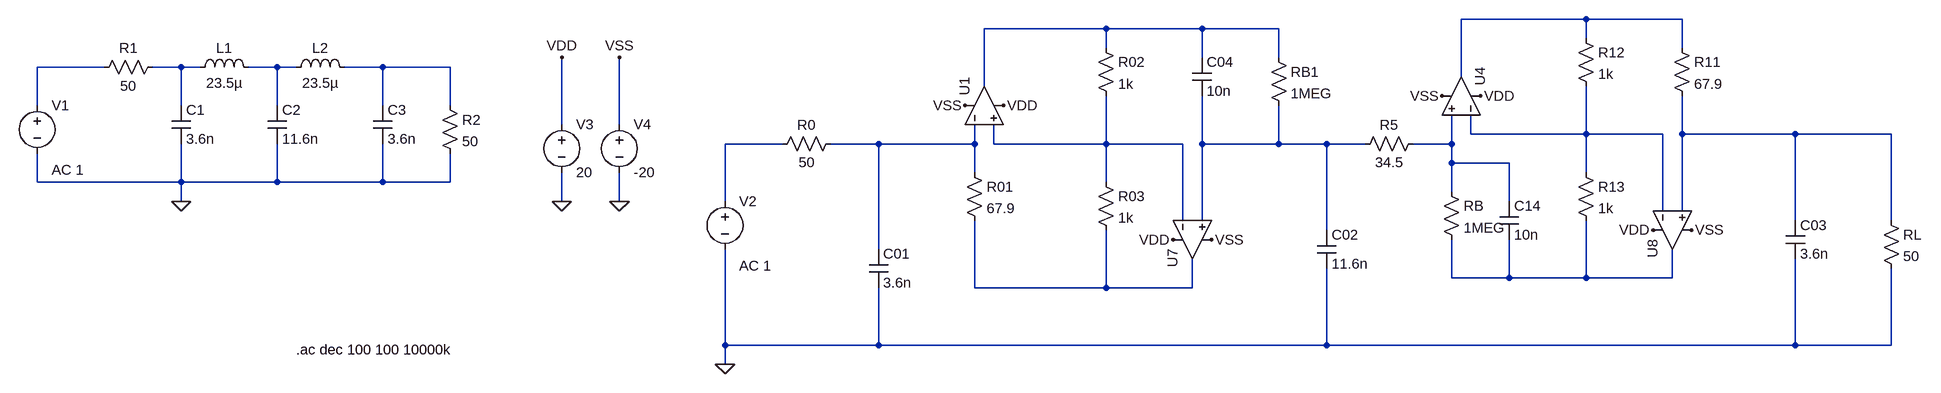
[diagram p0: schematic Gyrator.asc]
Gyrator.asc, the LTspice schematic file:
Version 4
SHEET 1 6264 1380
WIRE 2480 -16 2272 -16
WIRE 2640 -16 2480 -16
WIRE 1680 0 1472 0
WIRE 1840 0 1680 0
WIRE 1968 0 1840 0
WIRE 2480 16 2480 -16
WIRE 1680 32 1680 0
WIRE 2640 32 2640 -16
WIRE 1840 48 1840 0
WIRE 1968 48 1968 0
WIRE -16 64 -128 64
WIRE 112 64 64 64
WIRE 144 64 112 64
WIRE 272 64 224 64
WIRE 304 64 272 64
WIRE 448 64 384 64
WIRE 560 64 448 64
WIRE 2272 80 2272 -16
WIRE 1472 96 1472 0
WIRE -128 128 -128 64
WIRE 112 128 112 64
WIRE 272 128 272 64
WIRE 448 128 448 64
WIRE 560 128 560 64
WIRE 768 160 768 48
WIRE 864 160 864 48
WIRE 2288 176 2288 144
WIRE 2480 176 2480 96
WIRE 2480 176 2288 176
WIRE 2608 176 2480 176
WIRE 2640 176 2640 112
WIRE 2944 176 2640 176
WIRE 3104 176 2944 176
WIRE 1136 192 1040 192
WIRE 1296 192 1216 192
WIRE 1456 192 1456 160
WIRE 1456 192 1296 192
WIRE 1488 192 1488 160
WIRE 1680 192 1680 112
WIRE 1680 192 1488 192
WIRE 1808 192 1680 192
WIRE 1840 192 1840 112
WIRE 1968 192 1968 128
WIRE 1968 192 1840 192
WIRE 2048 192 1968 192
WIRE 2112 192 2048 192
WIRE 2256 192 2256 144
WIRE 2256 192 2192 192
WIRE 2256 224 2256 192
WIRE 2352 224 2256 224
WIRE 1456 240 1456 192
WIRE 2480 240 2480 176
WIRE -128 256 -128 208
WIRE 112 256 112 192
WIRE 112 256 -128 256
WIRE 272 256 272 192
WIRE 272 256 112 256
WIRE 448 256 448 192
WIRE 448 256 272 256
WIRE 560 256 560 208
WIRE 560 256 448 256
WIRE 1680 256 1680 192
WIRE 2256 272 2256 224
WIRE 112 288 112 256
WIRE 768 288 768 240
WIRE 864 288 864 240
WIRE 1040 288 1040 192
WIRE 2352 288 2352 224
WIRE 2608 304 2608 176
WIRE 2640 304 2640 176
WIRE 1808 320 1808 192
WIRE 1840 320 1840 192
WIRE 2944 320 2944 176
WIRE 3104 320 3104 176
WIRE 2048 336 2048 192
WIRE 1296 368 1296 192
WIRE 2256 416 2256 352
WIRE 2352 416 2352 352
WIRE 2352 416 2256 416
WIRE 2480 416 2480 320
WIRE 2480 416 2352 416
WIRE 2624 416 2624 368
WIRE 2624 416 2480 416
WIRE 1456 432 1456 320
WIRE 1680 432 1680 336
WIRE 1680 432 1456 432
WIRE 1824 432 1824 384
WIRE 1824 432 1680 432
WIRE 1040 528 1040 368
WIRE 1296 528 1296 432
WIRE 1296 528 1040 528
WIRE 2048 528 2048 400
WIRE 2048 528 1296 528
WIRE 2944 528 2944 384
WIRE 2944 528 2048 528
WIRE 3104 528 3104 400
WIRE 3104 528 2944 528
WIRE 1040 560 1040 528
FLAG 112 288 0
FLAG 1040 560 0
FLAG 768 288 0
FLAG 864 288 0
FLAG 768 48 VDD
FLAG 864 48 VSS
FLAG 1504 128 VDD
FLAG 2304 112 VDD
FLAG 1792 352 VDD
FLAG 2592 336 VDD
FLAG 1440 128 VSS
FLAG 1856 352 VSS
FLAG 2240 112 VSS
FLAG 2656 336 VSS
SYMBOL res 80 48 R90
WINDOW 0 0 56 VBottom 2
WINDOW 3 32 56 VTop 2
SYMATTR InstName R1
SYMATTR Value 50
SYMBOL ind 128 80 R270
WINDOW 0 32 56 VTop 2
WINDOW 3 5 56 VBottom 2
SYMATTR InstName L1
SYMATTR Value 23.5µ
SYMBOL ind 288 80 R270
WINDOW 0 32 56 VTop 2
WINDOW 3 5 56 VBottom 2
SYMATTR InstName L2
SYMATTR Value 23.5µ
SYMBOL cap 96 128 R0
SYMATTR InstName C1
SYMATTR Value 3.6n
SYMBOL cap 256 128 R0
SYMATTR InstName C2
SYMATTR Value 11.6n
SYMBOL cap 432 128 R0
SYMATTR InstName C3
SYMATTR Value 3.6n
SYMBOL res 544 112 R0
SYMATTR InstName R2
SYMATTR Value 50
SYMBOL voltage -128 112 R0
WINDOW 123 24 124 Left 2
WINDOW 39 0 0 Left 2
SYMATTR Value2 AC 1
SYMATTR InstName V1
SYMATTR Value ""
SYMBOL res 1232 176 R90
WINDOW 0 0 56 VBottom 2
WINDOW 3 32 56 VTop 2
SYMATTR InstName R0
SYMATTR Value 50
SYMBOL voltage 1040 272 R0
WINDOW 3 24 152 Left 2
WINDOW 123 24 124 Left 2
WINDOW 39 0 0 Left 2
SYMATTR Value ""
SYMATTR Value2 AC 1
SYMATTR InstName V2
SYMBOL voltage 768 144 R0
WINDOW 123 0 0 Left 2
WINDOW 39 0 0 Left 2
SYMATTR InstName V3
SYMATTR Value 20
SYMBOL voltage 864 144 R0
WINDOW 123 0 0 Left 2
WINDOW 39 0 0 Left 2
SYMATTR InstName V4
SYMATTR Value -20
SYMBOL cap 1280 368 R0
SYMATTR InstName C01
SYMATTR Value 3.6n
SYMBOL res 1440 224 R0
SYMATTR InstName R01
SYMATTR Value 67.9
SYMBOL res 1664 240 R0
SYMATTR InstName R03
SYMATTR Value 1k
SYMBOL res 1664 16 R0
SYMATTR InstName R02
SYMATTR Value 1k
SYMBOL cap 1824 48 R0
SYMATTR InstName C04
SYMATTR Value 10n
SYMBOL res 1952 32 R0
SYMATTR InstName RB1
SYMATTR Value 1MEG
SYMBOL res 2208 176 R90
WINDOW 0 0 56 VBottom 2
WINDOW 3 32 56 VTop 2
SYMATTR InstName R5
SYMATTR Value 34.5
SYMBOL res 2240 256 R0
SYMATTR InstName RB
SYMATTR Value 1MEG
SYMBOL res 2464 224 R0
SYMATTR InstName R13
SYMATTR Value 1k
SYMBOL res 2464 0 R0
SYMATTR InstName R12
SYMATTR Value 1k
SYMBOL res 2624 16 R0
SYMATTR InstName R11
SYMATTR Value 67.9
SYMBOL cap 2928 320 R0
SYMATTR InstName C03
SYMATTR Value 3.6n
SYMBOL res 3088 304 R0
SYMATTR InstName RL
SYMATTR Value 50
SYMBOL cap 2336 288 R0
SYMATTR InstName C14
SYMATTR Value 10n
SYMBOL cap 2032 336 R0
SYMATTR InstName C02
SYMATTR Value 11.6n
SYMBOL Opamps\\UniversalOpamp2 2272 112 M270
SYMATTR InstName U4
SYMBOL Opamps\\UniversalOpamp2 1824 352 M90
SYMATTR InstName U7
SYMBOL Opamps\\UniversalOpamp2 2624 336 M90
SYMATTR InstName U8
SYMBOL Opamps\\UniversalOpamp2 1472 128 R270
SYMATTR InstName U1
TEXT 304 536 Left 2 !.ac dec 100 100 10000k

The netlist it stands for:
* Gyrator.asc
R1 N004 N003 50
L1 N004 N005 23.5µ
L2 N005 N006 23.5µ
C1 N004 0 3.6n
C2 N005 0 11.6n
C3 N006 0 3.6n
R2 N006 0 50
V1 N003 0 AC 1
R0 N010 N009 50
V2 N009 0 AC 1
V3 VDD 0 20
V4 VSS 0 -20
C01 N010 0 3.6n
R01 N010 N015 67.9
R03 N011 N015 1k
R02 N002 N011 1k
C04 N002 N012 10n
RB1 N002 N012 1MEG
R5 N013 N012 34.5
RB N013 N014 1MEG
R13 N007 N014 1k
R12 N001 N007 1k
R11 N001 N008 67.9
C03 N008 0 3.6n
RL N008 0 50
C14 N013 N014 10n
C02 N012 0 11.6n
XU4 N013 N007 VDD VSS N001 level.2 Avol=1Meg GBW=10Meg Slew=10Meg ilimit=25m rail=0 Vos=0 phimargin=45 en=0 enk=0 in=0 ink=0 Rin=500Meg  ; pins IN+ IN- V+ V- OUT
XU7 N012 N011 VDD VSS N015 level.2 Avol=1Meg GBW=10Meg Slew=10Meg ilimit=25m rail=0 Vos=0 phimargin=45 en=0 enk=0 in=0 ink=0 Rin=500Meg  ; pins IN+ IN- V+ V- OUT
XU8 N008 N007 VDD VSS N014 level.2 Avol=1Meg GBW=10Meg Slew=10Meg ilimit=25m rail=0 Vos=0 phimargin=45 en=0 enk=0 in=0 ink=0 Rin=500Meg  ; pins IN+ IN- V+ V- OUT
XU1 N011 N010 VSS VDD N002 level.2 Avol=1Meg GBW=10Meg Slew=10Meg ilimit=25m rail=0 Vos=0 phimargin=45 en=0 enk=0 in=0 ink=0 Rin=500Meg  ; pins IN+ IN- V+ V- OUT
.ac dec 100 100 10000k
.lib UniversalOpamps2.sub
.backanno
.end